# Altium schematic sheet Change Log.SchDoc
size B; Author: AM; CompanyName: Expatria Technologies; DrawnBy: A.Marles; Engineer: AM; Organization: Expatria Technologies; Address1: Schematic; Address2: 101 Main Street, 14th Floor; Address3: Cambridge, MA 02142; Address4: USA; DocumentNumber: 14; SheetNumber: 14; SheetTotal: 14; PCB_Rev: A1
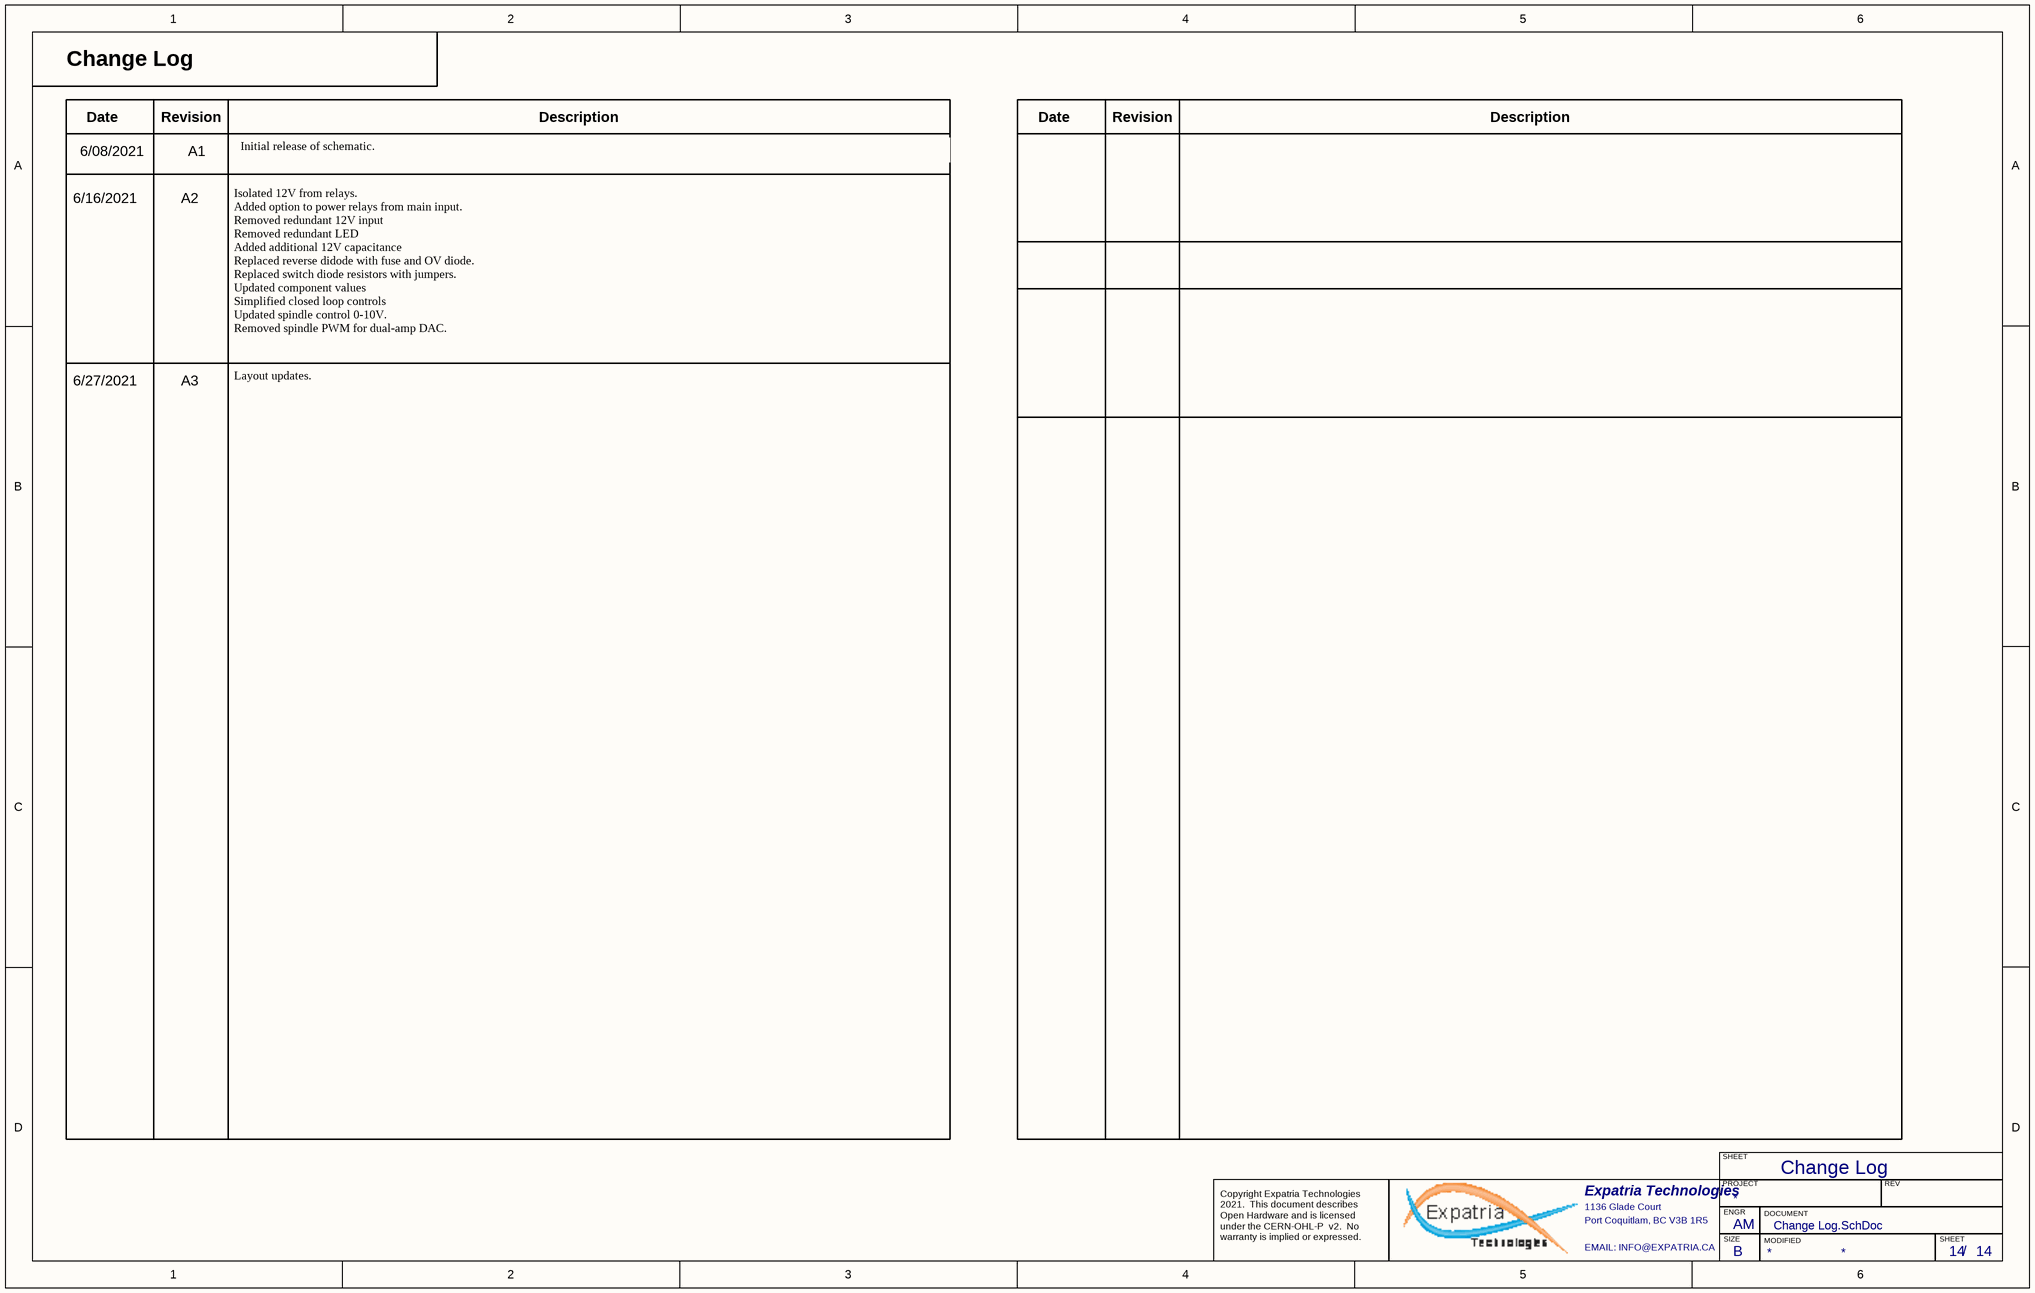
[diagram p0: Change Log.SchDoc]

## Notes on the sheet
- Change Log
- 6/08/2021
- Date
- Revision
- A1
- Initial release of schematic.
- Description
- 6/16/2021
- A2
- Isolated 12V from relays.
  Added option to power relays from main input.
  Removed redundant 12V input
  Removed redundant LED
  Added additional 12V capacitance
  Replaced reverse didode with fuse and OV diode.
  Replaced switch diode resistors with jumpers.
  Updated component values
  Simplified closed loop controls
  Updated spindle control 0-10V.
  Removed spindle PWM for dual-amp DAC.
- 6/27/2021
- A3
- Layout updates.
- SHEET
- Expatria Technologies
- 1136 Glade Court
- Port Coquitlam, BC V3B 1R5
- PROJECT
- SIZE
- ENGR
- MODIFIED
- DOCUMENT
- REV
- Copyright Expatria Technologies 2021.  This document describes Open Hardware and is licensed under the CERN-OHL-P  v2.  No warranty is implied or expressed.
- EMAIL: INFO@EXPATRIA.CA
- B
- /